# Altium project Inverter_DC.PrjPcb
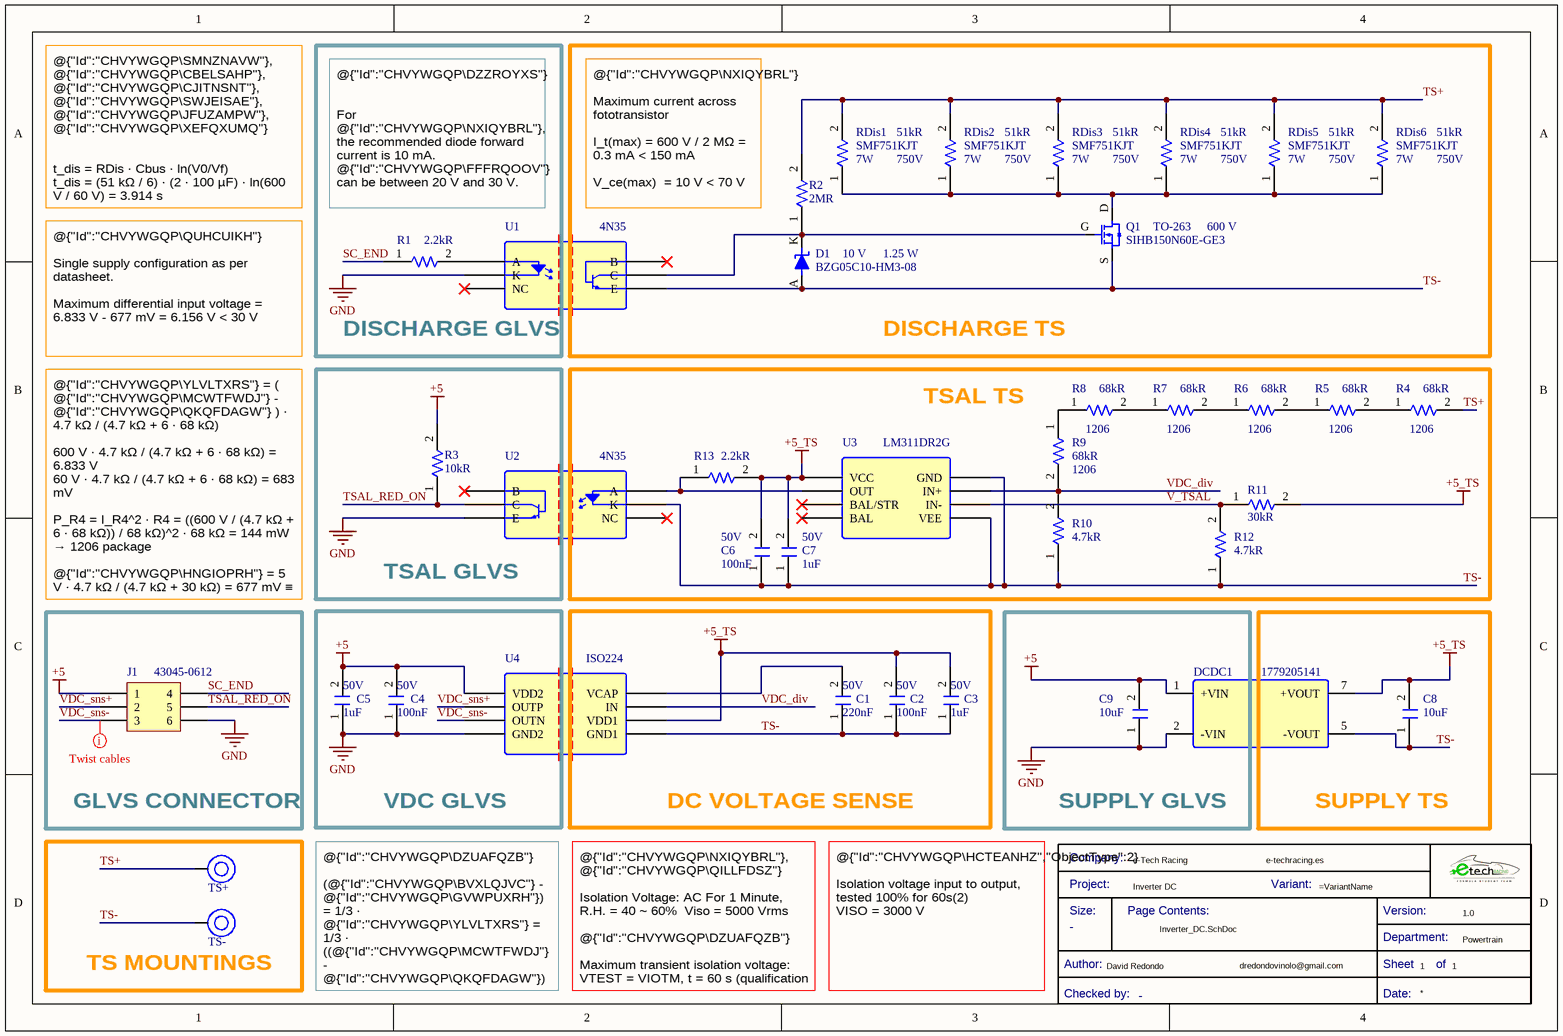
[diagram p0: Inverter_DC.SchDoc]
Company: e-Tech Racing; Department: Powertrain; DesignedByURL: e-techracing.es; DesignerMail: dredondovinolo@gmail.com; DesignerName: David Redondo; Project: Inverter DC; ReviewerName: -; Version: 1.0
1 sheet, 39 parts. Net scope: global (net labels, ports and power ports of the same name join across sheets).
Board file: Inverter_DC.PcbDoc

## Sheet Inverter_DC.SchDoc
size A4; SheetNumber: 1; SheetTotal: 1

### Parts
*?  Title Block_template  (value not drawn)  (graphical)
C1  Voltage Rating: 50V  Capacitance: 220nF  [C0805FNPC-W]  (hidden comment: 885012208058)
C2  Voltage Rating: 50V  Capacitance: 100nF  [C0805FNPC-R]  (hidden comment: 885012207098)
C3  Voltage Rating: 50V  Capacitance: 1uF  [C0805FNPC-R]  (hidden comment: 885012207103)
C4  Voltage Rating: 50V  Capacitance: 100nF  [C0805FNPC-R]  (hidden comment: 885012207098)
C5  Voltage Rating: 50V  Capacitance: 1uF  [C0805FNPC-R]  (hidden comment: 885012207103)
C6  Voltage Rating: 50V  Capacitance: 100nF  [C0805FNPC-R]  (hidden comment: 885012207098)
C7  Voltage Rating: 50V  Capacitance: 1uF  [C0805FNPC-R]  (hidden comment: 885012207103)
C8  10uF  [C0805FNPC-W]
C9  10uF  [C0805FNPC-W]
D1  Manufacturer Part Number 1: BZG05C10-HM3-08  V_z: 10 V  Power rating: 1.25 W  [DZ-6.2V-DO-214AC]  (hidden comment: BZG05C10)
DCDC1  1779205141  [1779205141]
J1  43045-0612  [J_MicroFit_2x3_V]
Q1  SIHB150N60E-GE3  Vds(max): 600 V  Package: TO-263  [SIHB150N60E-GE3]
R1  Resistance: 2.2kR  [R1206FTK-W]  (hidden comment: CR1206-FX-2201ELF)
R2  Resistance: 2MR  [R2512FTK]  (hidden comment: R2M-2512FTK)
R3  Resistance: 10kR  [R1206FTK-W]  (hidden comment: CRCW120610K0FKEA)
R4  Resistance: 68kR  Size: 1206  [R1206FTK-W]  (hidden comment: CR1206AFX-6802EAS)
R5  Resistance: 68kR  Size: 1206  [R1206FTK-W]  (hidden comment: CR1206AFX-6802EAS)
R6  Resistance: 68kR  Size: 1206  [R1206FTK-W]  (hidden comment: CR1206AFX-6802EAS)
R7  Resistance: 68kR  Size: 1206  [R1206FTK-W]  (hidden comment: CR1206AFX-6802EAS)
R8  Resistance: 68kR  Size: 1206  [R1206FTK-W]  (hidden comment: CR1206AFX-6802EAS)
R9  Resistance: 68kR  Size: 1206  [R1206FTK-W]  (hidden comment: CR1206AFX-6802EAS)
R10  Resistance: 4.7kR  [R1206FTK-W]  (hidden comment: CRS1206-FX-4701ELF)
R11  Resistance: 30kR  [R1206FTK-W]  (hidden comment: CRCW120630K0FKEA)
R12  Resistance: 4.7kR  [R1206FTK-W]  (hidden comment: CRS1206-FX-4701ELF)
R13  Resistance: 2.2kR  [R1206FTK-W]  (hidden comment: CR1206-FX-2201ELF)
RDis1  SMF751KJT  value 51kR  Operating Supply Voltage: 750V  Power Rating: 7W  [SMF751KJT]
RDis2  SMF751KJT  value 51kR  Operating Supply Voltage: 750V  Power Rating: 7W  [SMF751KJT]
RDis3  SMF751KJT  value 51kR  Operating Supply Voltage: 750V  Power Rating: 7W  [SMF751KJT]
RDis4  SMF751KJT  value 51kR  Operating Supply Voltage: 750V  Power Rating: 7W  [SMF751KJT]
RDis5  SMF751KJT  value 51kR  Operating Supply Voltage: 750V  Power Rating: 7W  [SMF751KJT]
RDis6  SMF751KJT  value 51kR  Operating Supply Voltage: 750V  Power Rating: 7W  [SMF751KJT]
TS+  Mounting_Hole_M4  [Mounting_Hole_M4]  (value not drawn)
TS-  Mounting_Hole_M4  [Mounting_Hole_M4]  (value not drawn)
U1  4N35  [Optocoupler_4N35]
U2  4N35  [Optocoupler_4N35]
U3  LM311DR2G  [LM311]
U4  ISO224  [ISO224]

### Blocks framed on the sheet
DISCHARGE GLVS: R1
DISCHARGE TS: D1 Q1 R2 RDis1-RDis6
TSAL GLVS: R3
TSAL TS: C6 C7 R4-R13 U3
GLVS CONNECTOR: J1
VDC GLVS: C4 C5
DC VOLTAGE SENSE: C1-C3
SUPPLY GLVS: C9
SUPPLY TS: C8 DCDC1
TS MOUNTINGS: TS+ TS-

### Nets
+5: C4.2 C5.2 C9.2 DCDC1.1(+VIN) J1.1 R3.2 U4.8(VDD2)
+5_TS: C2.2 C3.2 C6.2 C7.2 C8.2 DCDC1.7(+VOUT) R11.2 R13.2 U3.8(VCC) U4.3(VDD1)
GND: C4.1 C5.1 C9.1 DCDC1.2(-VIN) J1.6 U1.2(K) U2.4(E) U4.5(GND2)
SC_END: J1.4 R1.1
TS+: R2.2 R4.2 RDis1.2 RDis2.2 RDis3.2 RDis4.2 RDis5.2 RDis6.2 TS+.1
TS-: C1.1 C2.1 C3.1 C6.1 C7.1 C8.1 D1.A DCDC1.5(-VOUT) Q1.S R10.1 R12.1 TS-.1 U1.4(E) U2.2(K) U3.1(GND) U3.4(VEE) U4.4(GND1)
TSAL_RED_ON: J1.5 R3.1 U2.5(C)
V_TSAL: R11.1 R12.2 U3.3(IN-)
VDC_div: R9.2 R10.2 U3.2(IN+) U4.2(IN)
VDC_sns+: J1.2 U4.7(OUTP)
VDC_sns-: J1.3 U4.6(OUTN)
NetC1_2: C1.2 U4.1(VCAP)
NetD1_K: D1.K Q1.G R2.1 U1.5(C)
NetQ1_D: Q1.D RDis1.1 RDis2.1 RDis3.1 RDis4.1 RDis5.1 RDis6.1
NetR1_2: R1.2 U1.1(A)
NetR4_1: R4.1 R5.2
NetR5_1: R5.1 R6.2
NetR6_1: R6.1 R7.2
NetR7_1: R7.1 R8.2
NetR8_1: R8.1 R9.1
NetR13_1: R13.1 U2.1(A) U3.7(OUT)

Not connected (* = marked no-connect by the designer): U1 3(NC)* 6(B)*; U2 3(NC)* 6(B)*; U3 5(BAL)* 6(BAL/STR)*

### Layout directives
mark named Twist cables: VDC_sns-

### Notes on the sheet
- @{"Id":"CHVYWGQP\SMNZNAVW"}, @{"Id":"CHVYWGQP\CBELSAHP"}, @{"Id":"CHVYWGQP\CJITNSNT"}, @{"Id":"CHVYWGQP\SWJEISAE"}, @{"Id":"CHVYWGQP\JFUZAMPW"}, @{"Id":"CHVYWGQP\XEFQXUMQ"}
  t_dis = RDis · Cbus · ln(V0/Vf)
  t_dis = (51 kΩ / 6) · (2 · 100 µF) · ln(600 V / 60 V) = 3.914 s
  P(RDis) = V_max ^ 2 / RDis = 588^2 / 51 kΩ = 6.78 W < 7 W
- @{"Id":"CHVYWGQP\DZZROYXS"}
  For @{"Id":"CHVYWGQP\NXIQYBRL"}, the recommended diode forward current is 10 mA. @{"Id":"CHVYWGQP\FFFRQOOV"}  can be between 20 V and 30 V.
  I_min = 20 V / 2.2 kΩ= 9.1 mA
  I_max = 30 V / 2.2 kΩ = 13.6 mA
- @{"Id":"CHVYWGQP\NXIQYBRL"}
  Maximum current across fototransistor
  I_t(max) = 600 V / 2 MΩ = 0.3 mA < 150 mA
  V_ce(max)  = 10 V < 70 V
- @{"Id":"CHVYWGQP\QUHCUIKH"}
  Single supply configuration as per datasheet.
  Maximum differential input voltage = 6.833 V - 677 mV = 6.156 V < 30 V
- @{"Id":"CHVYWGQP\YLVLTXRS"} = ( @{"Id":"CHVYWGQP\MCWTFWDJ"} - @{"Id":"CHVYWGQP\QKQFDAGW"} ) · 4.7 kΩ / (4.7 kΩ + 6 · 68 kΩ)
  600 V · 4.7 kΩ / (4.7 kΩ + 6 · 68 kΩ) = 6.833 V
  60 V · 4.7 kΩ / (4.7 kΩ + 6 · 68 kΩ) = 683 mV
  P_R4 = I_R4^2 · R4 = ((600 V / (4.7 kΩ + 6 · 68 kΩ)) / 68 kΩ)^2 · 68 kΩ = 144 mW → 1206 package
  @{"Id":"CHVYWGQP\HNGIOPRH"} = 5 V · 4.7 kΩ / (4.7 kΩ + 30 kΩ) = 677 mV ≡ 59.46 V in @{"Id":"CHVYWGQP\MCWTFWDJ"} - @{"Id":"CHVYWGQP\QKQFDAGW"}
- @{"Id":"CHVYWGQP\DZUAFQZB"}
  (@{"Id":"CHVYWGQP\BVXLQJVC"} - @{"Id":"CHVYWGQP\GVWPUXRH"}) = 1/3 · @{"Id":"CHVYWGQP\YLVLTXRS"} = 1/3 · ((@{"Id":"CHVYWGQP\MCWTFWDJ"} - @{"Id":"CHVYWGQP\QKQFDAGW"}) 4.7 kΩ / (4.7 kΩ + 6 · 68 kΩ)) = 1/3 · 0.011388 · (@{"Id":"CHVYWGQP\MCWTFWDJ"} - @{"Id":"CHVYWGQP\QKQFDAGW"})
  (@{"Id":"CHVYWGQP\BVXLQJVC"} - @{"Id":"CHVYWGQP\GVWPUXRH"}) = 1/3 · 0.011388 · 600 V = 2.278 V
- @{"Id":"CHVYWGQP\NXIQYBRL"}, @{"Id":"CHVYWGQP\QILLFDSZ"}
  Isolation Voltage: AC For 1 Minute, R.H. = 40 ~ 60%  Viso = 5000 Vrms
  @{"Id":"CHVYWGQP\DZUAFQZB"}
  Maximum transient isolation voltage: VTEST = VIOTM, t = 60 s (qualification test) VIOTM = 7071 Vpk
- (near *?) @{"Id":"CHVYWGQP\HCTEANHZ","ObjectType":2}
  Isolation voltage input to output, tested 100% for 60s(2)
  VISO = 3000 V
- (in symbol Title Block_template) Company:; Project:; Variant:; Size:; Page Contents:; Version:; Department:; Author:; Sheet; of; Checked by:; Date:

### Library data of the parts
*? = Title Block_template: Standard Title Block; .Creator: GP; Category: Title Block; .PCBcheck: GP; .SCHcheck: GP; Checked by:: -; Size: -
C1 = C0.22u-0805FNPC-X5R: Cap Ceramic 0.22uF 50V X5R 10% Pad SMD 0805 85C Low ESR Automotive T/R; Manufacturer: Taiyo Yuden; Manufacturer Part Number: UMK212BJ224KGHT; .Creator: DR; Category: Capacitor; ComponentLink1Description: Datasheet; ComponentLink1URL: https://eu.mouser.com/datasheet/2/396/taiyo_yuden_12132018_mlcc11_hq_e-1510082.pdf; ComponentLink2Description: Where buy it; ComponentLink2URL: https://eu.mouser.com/ProductDetail/Taiyo-Yuden/UMK212BJ224KGHT?qs=CNQs48zzdnpf%2FbZJTfp33Q%3D%3D; Supplier 1: Digi-Key; RoHS: Yes; Stock 1: 900; Pricing 1: 1=0,20000, 10=0,13700, 50=0,08220, 100=0,06950, 500=0,04754, 1000=0,04206 (USD); Mount: Surface Mount; Case/Package: 0805; Case Code (Metric): 2012; Case Code (Imperial): 0805; Min Operating Temperature: -55°C; Max Operating Temperature: 85°C; Package Quantity: 3000; Packaging: Tape and Reel; Tolerance: 10%; Voltage Rating (DC): 50V; Dielectric: X5R; Termination: SMD/SMT; Length: 0.079inch; Width: 0.049inch; Height: 1.25mm; Thickness: 0.053inch; Ratings: AEC-Q200; Lead Free: Lead Free; Halogen Free: Halogen Free; RoHS Compliant: Yes; Supplier Part Number 1: 587-3514-1-ND
C2 C4 C6 = C100n-50V-0805FNPC-X7R: Cap, 0.1ΜF, 50V, 10%, X7R, 0805; Manufacturer 1: Wurth Electronics; .Creator: DR; Supplier 1: RSComponents; Manufacturer Part Number 1: 885012207098; RoHS: Yes; Category: Ceramic Capacitors; Stock 1: 8000; Pricing 1: 100=0,10200, 500=0,07100, 2000=0,06100 (GBP); Mount: Surface Mount; Case/Package: 0805; Case Code (Metric): 2012; Case Code (Imperial): 0805; Min Operating Temperature: -55°C; Max Operating Temperature: 125°C; Packaging: Cut Tape; Dielectric: X7R; Tolerance: 10%; Voltage Rating (DC): 50V; Length: 0.079inch; Width: 0.049inch; Thickness: 0.035inch; REACH SVHC: Unknown; RoHS Compliant: Yes; ComponentLink1URL: http://www.farnell.com/datasheets/1958498.pdf?src-supplier=Farnell; ComponentLink1Description: http://www.farnell.com/datasheets/1958498.pdf?src-supplier=Farnell; ComponentLink2URL: http://www.farnell.com/datasheets/1958498.pdf?src-supplier=Element14; ComponentLink2Description: http://www.farnell.com/datasheets/1958498.pdf?src-supplier=Element14; ComponentLink3URL: https://katalog.we-online.de/pbs/datasheet/885012207098.pdf?src-supplier=Digi-Key; ComponentLink3Description: https://katalog.we-online.de/pbs/datasheet/885012207098.pdf?src-supplier=Digi-Key; ComponentLink4URL: http://www.farnell.com/datasheets/1958498.pdf?src-supplier=Newark; ComponentLink4Description: http://www.farnell.com/datasheets/1958498.pdf?src-supplier=Newark; Supplier Part Number 1: 1813493
C3 C5 C7 = C1u-50V-0805FNPC-X7R: Multilayer Ceramic Capacitor, Wcap-Csgp Series, 1 F, 10%, X7R, 50 V, 0805 [2012 Metric] Rohs Compliant: Yes; Manufacturer 1: Wurth Electronics; .Creator: GP; Supplier 1: RSComponents; Manufacturer Part Number 1: 885012207103; RoHS: Yes; Category: Ceramic Capacitors; Stock 1: 5100; Pricing 1: 50=0,27200, 250=0,25300, 500=0,22800, 1250=0,20100, 2500=0,17100 (GBP); Mount: Surface Mount; Case/Package: 0805; Case Code (Metric): 2012; Case Code (Imperial): 0805; Min Operating Temperature: -55°C; Max Operating Temperature: 85°C; Packaging: Cut Tape; Dielectric: X7R; Tolerance: 10%; Voltage Rating (DC): 50V; Length: 0.079inch; Width: 0.049inch; Thickness: 0.053inch; REACH SVHC: Unknown; RoHS Compliant: Yes; ComponentLink1URL: http://www.farnell.com/datasheets/1958501.pdf?src-supplier=Farnell; ComponentLink1Description: http://www.farnell.com/datasheets/1958501.pdf?src-supplier=Farnell; ComponentLink2URL: http://www.farnell.com/datasheets/1958501.pdf?src-supplier=Element14; ComponentLink2Description: http://www.farnell.com/datasheets/1958501.pdf?src-supplier=Element14; ComponentLink3URL: https://katalog.we-online.de/pbs/datasheet/885012107003.pdf?src-supplier=Digi-Key; ComponentLink3Description: https://katalog.we-online.de/pbs/datasheet/885012107003.pdf?src-supplier=Digi-Key; ComponentLink4URL: http://www.farnell.com/datasheets/1958501.pdf?src-supplier=Newark; ComponentLink4Description: http://www.farnell.com/datasheets/1958501.pdf?src-supplier=Newark; Supplier Part Number 1: 1813523
C8 C9 = C10uF-50V-0805FNPC
D1 = DZ-6.2V-DO-214AC: Zener Diode, 10V V(Z), 6%, 1.25W, Silicon, Unidirectional, DO-214AC; Manufacturer 1: Vishay Semiconductors; ComponentLink1Description: Datasheet; ComponentLink1URL: http://www.mouser.com/ds/2/427/bzg05c-710097.pdf?src-supplier=Mouser; ComponentLink3URL: http://www.mouser.com/ds/2/427/bzg05c-710097.pdf?src-supplier=Mouser; ComponentLink3Description: http://www.mouser.com/ds/2/427/bzg05c-710097.pdf?src-supplier=Mouser; ComponentLink4URL: http://www.vishay.com/docs/85893/bzg05c.pdf?src-supplier=Avnet; ComponentLink4Description: http://www.vishay.com/docs/85893/bzg05c.pdf?src-supplier=Avnet; ComponentLink5URL: http://www.vishay.com/docs/85893/bzg05c.pdf?src-supplier=Digi-Key; ComponentLink5Description: http://www.vishay.com/docs/85893/bzg05c.pdf?src-supplier=Digi-Key; Supplier 1: Mouser; Supplier Part Number 1: 78-BZG05C10-HM3-08; RoHS: Yes; Category: Zener Diodes; Stock 1: 1500; Pricing 1: 1=0,42, 10=0,323, 50=0,323, 100=0,194, 1000=0,122, 10000=0,122 (USD); RoHS Compliant: Yes
DCDC1 = 1779205141: WPME-FISM Fixed Isolated Module, SIP-7, 5Vin, 5Vout; Manufacturer: Wurth Elektronik; Input Voltage: 5V; Input Voltage Min: 4.5V; Input Voltage Max: 5.5V; Isolation Voltage: 3000V; Output Power: 1W; Manufacturer Part Number: 1779205141; Category: Isolated Converter; Match Code: WPME-FISM; ComponentLink1Description: Website Link; ComponentLink1URL: https://www.we-online.com/redexpert/article/1779205141?ad; ComponentLink2Description: Datasheet Link; ComponentLink2URL: https://www.we-online.com/redexpert/spec/1779205141?ad; Mount: Through Hole; Operating Temperature Max: 105°C; Operating Temperature Min: -40°C; Packaging: Tube; Case/Size Code: SIP-7; Length: 19.65mm; Width: 6mm; Height: 10.16mm; Output Voltage: 5V
J1 = J_MicroFit_2x3_V: Micro fit Header, 2 Row, Vertical, Polarizing Peg, 6 Pin, Tin Plate, SMT/Glow Wire, Kinked Leads; Manufacturer: Molex; .Creator: DO; ComponentLink8Description: Where buy it; ComponentLink8URL: https://www.molex.com/molex/products/part-detail/pcb_headers/0430450612; Supplier 1: RSComponents; Manufacturer Part Number: 43045-0612; RoHS: Yes; Category: Headers and Wire Housings; Stock 1: 2635; Pricing 1: 5=1,45500, 100=1,26700, 375=1,08900, 1500=0,90900, 3000=0,72900 (USD); ComponentLink1URL: https://www.molex.com/pdm_docs/sd/430450612_sd.pdf; ComponentLink1Description: Datasheet; ComponentLink2URL: https://datasheet.ciiva.com/11748/0900766b800bd7d2-11748707.pdf?src-supplier=RSComponents; ComponentLink2Description: https://datasheet.ciiva.com/11748/0900766b800bd7d2-11748707.pdf?src-supplier=RSComponents; ComponentLink3URL: https://datasheet.ciiva.com/19462/883464-19462371.pdf?src-supplier=Jameco; ComponentLink3Description: https://datasheet.ciiva.com/19462/883464-19462371.pdf?src-supplier=Jameco; ComponentLink4URL: https://datasheet.ciiva.com/30194/128550430450612-pcb-headers-30194512.pdf?src-supplier=Onlinecomponents.com; ComponentLink4Description: https://datasheet.ciiva.com/30194/128550430450612-pcb-headers-30194512.pdf?src-supplier=Onlinecomponents.com; ComponentLink5URL: https://datasheet.ciiva.com/9468/0430450612-pcb-headers-9468492.pdf?src-supplier=Avnet; ComponentLink5Description: https://datasheet.ciiva.com/9468/0430450612-pcb-headers-9468492.pdf?src-supplier=Avnet; Supplier Part Number 1: 2332898
Q1 = SIHB150N60E-GE3: Mosfet, N-ch, 600V, 22A, TO-263 Rohs Compliant: Yes; Manufacturer 1: Vishay; Vgs(typ): 10 V; Supplier 1: Digi-Key; Stock 1: 1000; Pricing 1: 1=3,670000, 10=3,081000, 100=2,492500, 500=2,215540 (USD); Supplier Part Number 1: 742-SIHB150N60E-GE3CT-ND; Ids(max): 22 A; Manufacturer Part Number 1: SIHB150N60E-GE3
R1 R13 = R2.2K-1206FTK: Res Thick Film 1206 2.2K Ohm 1% 1/4W ±100ppm/°C Molded SMD SMD Paper Tape on Plastic Reel; Manufacturer 1: Bourns; Power Rating: 250mW; Voltage Rating: 200V; .Creator: AC; Supplier 1: Digi-Key; Manufacturer Part Number 1: CR1206-FX-2201ELF; RoHS: Yes; Category: Chip SMD Resistors; Stock 1: 150; Pricing 1: 1=0,10000, 10=0,04200, 100=0,01700, 1000=0,00762, 2500=0,00661 (USD); Mount: Surface Mount; Case/Package: 1206; Number of Pins: 2; Contact Plating: Tin; Case Code (Metric): 3216; Case Code (Imperial): 1206; Min Operating Temperature: -55°C; Max Operating Temperature: 155°C; Tolerance: 1%; Resistor Type: Thick Film; Temperature Coefficient: 100ppm/°C; Packaging: Tape and Reel; Package Quantity: 5000; Number of Terminations: 2; Termination: SMD/SMT; Max Power Dissipation: 250mW; Voltage Rating (DC): 200V; Features: Moisture Resistant; Series: CR1206; Resistance Tolerance: 1%; Construction: Rectangular; Technology: THICK FILM; Length: 3.2mm; Width: 1.6mm; Height: 0.6mm; Depth: 1.6mm; Thickness: 610um; Radiation Hardening: No; REACH SVHC: No SVHC; Military Standard: Not; RoHS Compliant: Yes; ComponentLink1URL: https://datasheet.ciiva.com/11809/0900766b80fcdb72-11809898.pdf?src-supplier=RSComponents; ComponentLink1Description: https://datasheet.ciiva.com/11809/0900766b80fcdb72-11809898.pdf?src-supplier=RSComponents; ComponentLink2URL: https://datasheet.ciiva.com/9123/chpreztr-9123227.pdf?src-supplier=Avnet; ComponentLink2Description: https://datasheet.ciiva.com/9123/chpreztr-9123227.pdf?src-supplier=Avnet; ComponentLink3URL: https://datasheet.ciiva.com/16770/70154685-16770447.pdf?src-supplier=Allied+Electronics; ComponentLink3Description: https://datasheet.ciiva.com/16770/70154685-16770447.pdf?src-supplier=Allied+Electronics; ComponentLink4URL: https://datasheet.ciiva.com/7985/1856384-7985879.pdf?src-supplier=Element14; ComponentLink4Description: https://datasheet.ciiva.com/7985/1856384-7985879.pdf?src-supplier=Element14; ComponentLink5URL: https://datasheet.ciiva.com/22693/1902866-22693258.pdf?src-supplier=Element14; ComponentLink5Description: https://datasheet.ciiva.com/22693/1902866-22693258.pdf?src-supplier=Element14; Supplier Part Number 1: CR1206-FX-2201ELFCT-ND; ComponentLink6Description: RS; ComponentLink6URL: https://es.rs-online.com/web/p/resistencias-fijas-para-montaje-en-superficie/7409097/
R2 = R2M-2512FTK: Current Sense Resistors - SMD 3watts .002ohms 1%; Manufacturer: Vishay Dale; Manufacturer Part Number: WSLP25122L000FEA; Temperature Coefficient: 275ppm/°C; Power Rating: 3W; Supplier 1: Mouser; RoHS: Yes; Category: Chip SMD Resistors; Stock 1: 11994; Pricing 1: 1=1,07000, 10=1,07000, 50=1,07000, 100=1,07000, 1000=0,77100, 10000=0,75500 (USD); Mount: Surface Mount; Case/Package: 2512; Case Code (Imperial): 2512; Case Code (Metric): 6432; Weight: 0.001429oz; Size Code: 2512; Min Operating Temperature: -65°C; Max Operating Temperature: 170°C; Tolerance: 1%; Packaging: Tape and Reel; Resistor Type: Metal Strip; Package Quantity: 2000; Termination: SMD/SMT; Series: WSLP; Length: 6.4mm; Width: 3.2mm; Height: 0.635mm; RoHS Compliant: Yes; Lead Free: Lead Free; ComponentLink1URL: https://datasheet.ciiva.com/48527/wslp-48527354.pdf?src-supplier=Avnet; ComponentLink1Description: https://datasheet.ciiva.com/48527/wslp-48527354.pdf?src-supplier=Avnet; Supplier Part Number 1: 71-WSLP25122L000FEA
R3 = R10k-1206FTK: Res Thick Film 1206 10K Ohm 1% 0.25W(1/4W) +/-100ppm/ßC Pad SMD Automotive T/R; Temperature Coefficient: 100ppm/°C; Voltage Rating: 200V; .Creator: GP; Category: Resistor; ComponentLink1Description: Datasheet; ComponentLink1URL: https://docs.rs-online.com/bca8/A700000006404581.pdf; ComponentLink2Description: Where buy it; ComponentLink2URL: https://es.rs-online.com/web/p/resistencias-de-montaje-en-superficie/6791765; Supplier 1: Allied Electronics; Case/Package: 1206; Number of Pins: 2; Contact Plating: Tin; Weight: 0.000353oz; Case Code (Metric): 3216; Case Code (Imperial): 1206; Package Shape: Rectangular; Size Code: 1206; Terminal Finish: Tin; Resistor Type: Thick Film; Package Quantity: 10; Number of Terminations: 2; Termination: SMD/SMT; Voltage Rating (DC): 200V; Features: Automotive AEC-Q200; Series: CRCW; Construction: Rectangular; Resistance Tolerance: 1%; Working Voltage: 200V; Length: 3.2mm; Width: 0.063inch; Height: 0.55mm; Depth: 1.6mm; Radiation Hardening: No; Lead Free: Lead Free; RoHS Compliant: Yes; REACH SVHC: Unknown; Military Standard: Not; Supplier Part Number 1: 70201262
R4-R9 = R68k-1206FTK: Resistor, AS 1206 68k1% 250mW TC100; Manufacturer: Bourns; .Creator: DO; Supplier 1: Newark; Manufacturer Part Number: CR1206AFX-6802EAS; RoHS: Yes; Category: Chip SMD Resistors; Stock 1: 4700; Pricing 1: 1=0,01100, 25=0,01100, 50=0,01100, 100=0,01100, 250=0,01100, 500=0,01100 (USD); Supplier Part Number 1: 16AH0632; ComponentLink1Description: Where buy it; ComponentLink1URL: https://www.mouser.es/ProductDetail/Bourns/CR1206AFX-6802EAS?qs=PzGy0jfpSMtMA5jyzS7M7w%3D%3D; ComponentLink2Description: Datasheet; ComponentLink2URL: https://www.mouser.es/datasheet/2/54/cr_a_as-1858644.pdf
R10 R12 = R4.7K-1206FTK: Res Thick Film 1206 4.7K Ohm 1% 1/2W ±100ppm/°C Molded SMD T/R; Manufacturer 1: Bourns JW Miller; Voltage Rating: 400V; Power Rating: 500mW; .Creator: AC; Supplier 1: Digi-Key; RoHS: Yes; Category: Chip SMD Resistors; Pricing 1: 1=0,42000, 10=0,35400, 100=0,13850, 1000=0,05796, 2500=0,05313 (USD); Mount: Surface Mount; Case/Package: 1206; Case Code (Metric): 3016; Case Code (Imperial): 1206; Min Operating Temperature: -55°C; Max Operating Temperature: 155°C; Packaging: Cut Tape; Resistor Type: Thick Film; Number of Terminations: 2; Termination: SMD/SMT; Working Voltage: 400V; Voltage Rating (DC): 400V; Tolerance: 1%; Max Power Dissipation: 500mW; Temperature Coefficient: 100ppm/°C; Length: 0.122inch; Width: 0.063inch; Height: 0.026inch; REACH SVHC: No SVHC; ComponentLink1URL: https://datasheet.ciiva.com/48986/70483705-48986735.pdf?src-supplier=Allied+Electronics; ComponentLink1Description: https://datasheet.ciiva.com/48986/70483705-48986735.pdf?src-supplier=Allied+Electronics; Supplier Part Number 1: CRS1206-FX-4701ELFCT-ND; ComponentLink3Description: RS; ComponentLink3URL: https://es.rs-online.com/web/p/resistencias-de-montaje-en-superficie/8672965; Manufacturer Part Number 1: CRS1206-FX-4701ELF
R11 = R30k-1206FTK: Res Thick Film 1206 30K Ohm 1% 1/4W ±100ppm/°C Molded SMD SMD Paper T/R; Manufacturer: Vishay; Power Rating: 250mW; Voltage Rating: 200V; .Creator: GP; Category: Resistor; ComponentLink1Description: Datasheet; ComponentLink1URL: https://docs.rs-online.com/bca8/A700000006404581.pdf; ComponentLink2Description: Where buy it; ComponentLink2URL: https://es.rs-online.com/web/p/resistencias-de-montaje-en-superficie/6792039; Supplier 1: RSComponents; Manufacturer Part Number: CRCW120630K0FKEA; RoHS: Yes; Stock 1: 3550; Pricing 1: 50=0,12000, 500=0,11200, 1000=0,10400, 2000=0,09700, 4000=0,08900 (USD); Case/Package: 1206; Number of Pins: 2; Contact Plating: Tin; Case Code (Imperial): 1206; Case Code (Metric): 3216; Weight: 0.000353oz; Size Code: 1206; Min Operating Temperature: -55°C; Max Operating Temperature: 155°C; Tolerance: 1%; Resistor Type: Thick Film; Packaging: Tape and Reel; Temperature Coefficient: 100ppm/°C; Package Quantity: 10; Termination: SMD/SMT; Number of Terminations: 2; Max Power Dissipation: 250mW; Features: Automotive AEC-Q200; Series: CRCW; Construction: Rectangular; Resistance Tolerance: 1%; Technology: THICK FILM; Length: 3.2mm; Width: 1.6mm; Height: 0.55mm; Depth: 1.6mm; Radiation Hardening: No; RoHS Compliant: Yes; REACH SVHC: Unknown; Military Standard: Not; Supplier Part Number 1: 6792039
RDis1-RDis6 = SMF751KJT: Resistor Metal Film 51K Ohm 5% 7W ±100ppm/°C Molded SMD T/R; Manufacturer 1: TE Connectivity; Supplier 1: Digi-Key; Manufacturer Part Number 1: SMF751KJT; RoHS: Yes; Category: Chip SMD Resistors; Stock 1: 1156; Pricing 1: 1=2,33, 10=1,964, 25=1,9192, 50=1,8062, 100=1,4977 (USD); Supplier Part Number 1: 1712-SMF751KJTCT-ND
U1 U2 = Optocoupler_4N35: Optocoupler DC-IN 1-CH Transistor With Base DC-OUT 6-Pin PDIP SMD T/R; Manufacturer: Vishay Lite-On; Manufacturer Part Number: CNY17-4S-TA1; Number of Channels: 1; Max Power Dissipation: 250mW; Isolation Voltage: 5kV; Output Voltage: 70V; Forward Voltage: 1.65V; Rise Time: 10000ns; Collector Emitter Saturation Voltage: 300mV; Max Input Current: 60mA; Reverse Breakdown Voltage: 6V; Input Type: DC; Current Transfer Ratio: 320%; Output Current per Channel: 150mA; .Creator: DO; Supplier 1: RSComponents; RoHS: Yes; Category: Optocouplers; Stock 1: 1; Pricing 1: 50=0,27200, 250=0,25600, 500=0,24000, 1250=0,22500, 2500=0,21200 (USD); Mount: Surface Mount; Case/Package: SMD/SMT; Number of Pins: 6; Min Operating Temperature: -55°C; Max Operating Temperature: 100°C; Packaging: Tape and Reel; Package Quantity: 1000; Power Dissipation: 250mW; Collector Emitter Voltage (VCEO): 70V; Max Output Voltage: 70V; Number of Elements: 1; Series: -; Forward Current: 60mA; Collector-emitter Voltage-Max: 300mV; Fall Time: 10000ns; Number of Circuits: 1; Max Collector Current: 150mA; Radiation Hardening: No; Lead Free: Lead Free; RoHS Compliant: Yes; ComponentLink1URL: https://datasheet.ciiva.com/15118/getdatasheetpartid-187668-15118874.pdf?src-supplier=Verical; ComponentLink1Description: https://datasheet.ciiva.com/15118/getdatasheetpartid-187668-15118874.pdf?src-supplier=Verical; ComponentLink2URL: https://datasheet.ciiva.com/6573/s-110-cny17-6573733.pdf?src-supplier=Digi-Key; ComponentLink2Description: https://datasheet.ciiva.com/6573/s-110-cny17-6573733.pdf?src-supplier=Digi-Key; Supplier Part Number 1: 1278380P; ComponentLink3Description: Where buy it; ComponentLink3URL: https://es.rs-online.com/web/p/circuitos-integrados-optoacopladores/1257571
U3 = LM311DR2G: LM Series 36 V 300 nA Surface Mount Single Comparator - SOIC-8; Manufacturer 1: ON Semiconductor; Supplier 1: Future Electronics; Manufacturer Part Number 1: LM311DR2G; RoHS: Yes; Category: Comparators; Stock 1: 35000; Pricing 1: 2500=0,145, 5000=0,142, 10000=0,139, 12500=0,138, 37500=0,133 (USD); Supplier Part Number 1: 9254327
U4 = ISO224: Reinforced isolated amplifier for voltage sensing with ±12-V input 8-SOIC -55 to 125; Manufacturer 1: Texas Instruments; Manufacturer Part Number 1: ISO224ADWVR; Supplier 1: Mouser; RoHS: Yes; Category: Amplifiers - Op Amps, Buffer, Instrumentation; Stock 1: 3377; Pricing 1: 1=13,32, 10=12,25, 50=11,74, 100=10,35, 1000=8,44, 10000=8,44 (USD); ComponentLink1URL: https://www.ti.com/lit/ds/symlink/iso224.pdf?ts=1702215020753&ref_url=https%253A%252F%252Fwww.ti.com%252Fproduct%252Fes-mx%252FISO224; ComponentLink1Description: Datasheet; Supplier Part Number 1: 595-ISO224ADWVR